# Altium project Light-Controller.PrjPcb
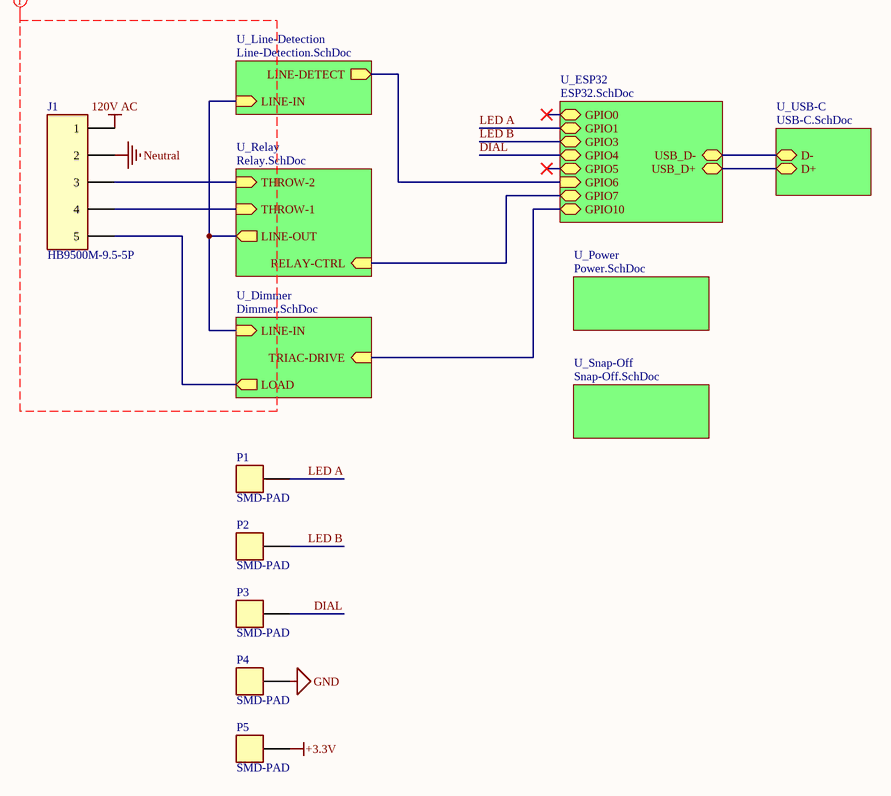
[diagram p0: Top-Level.SchDoc]
8 sheets, 66 parts. Net scope: hierarchical (ports join the sheet entries above them; power ports are global).
Board file: Light-Controller.PcbDoc
Sheets:
  Top-Level.SchDoc
    U_ESP32 = ESP32.SchDoc
    U_USB-C = USB-C.SchDoc
    U_Relay = Relay.SchDoc
    U_Dimmer = Dimmer.SchDoc
    U_Power = Power.SchDoc
    U_Line-Detection = Line-Detection.SchDoc
    U_Snap-Off = Snap-Off.SchDoc

## Sheet Top-Level.SchDoc
size A; SheetNumber: 1; SheetTotal: 8

### Parts
J1  HB9500M-9.5-5P  [CONN-TH_HB9500M-9.5-5P]
P1  SMD-PAD  [USER_SMD-PAD]  (no BOM)
P2  SMD-PAD  [USER_SMD-PAD]  (no BOM)
P3  SMD-PAD  [USER_SMD-PAD]  (no BOM)
P4  SMD-PAD  [USER_SMD-PAD]  (no BOM)
P5  SMD-PAD  [USER_SMD-PAD]  (no BOM)

### Sub-sheets
U_Dimmer = Dimmer.SchDoc: LOAD (out), TRIAC-DRIVE (in), LINE-IN (in)
U_ESP32 = ESP32.SchDoc: USB_D- (bidir), USB_D+ (bidir), GPIO10 (bidir), GPIO7 (bidir), GPIO6 (in), GPIO3 (bidir), GPIO4 (bidir), GPIO5 (bidir), GPIO0 (bidir), GPIO1 (bidir)
U_Line-Detection = Line-Detection.SchDoc: LINE-IN (in), LINE-DETECT (out)
U_Power = Power.SchDoc: no entries
U_Relay = Relay.SchDoc: RELAY-CTRL (in), THROW-1 (in), THROW-2 (in), LINE-OUT (out)
U_Snap-Off = Snap-Off.SchDoc: no entries
U_USB-C = USB-C.SchDoc: D- (bidir), D+ (bidir)

### Nets
120V AC: J1.1
+3.3V: P5.1
GND: P4.1
Neutral: J1.2
D_N: sheet U_ESP32/USB_D-, sheet U_USB-C/D-
D_P: sheet U_ESP32/USB_D+, sheet U_USB-C/D+
DIAL: P3.1 ; sheet U_ESP32/GPIO4
LED A: P1.1 ; sheet U_ESP32/GPIO1
LED B: P2.1 ; sheet U_ESP32/GPIO3
NetIC1_16: sheet U_ESP32/GPIO10, sheet U_Dimmer/TRIAC-DRIVE
NetIC1_20: sheet U_ESP32/GPIO6, sheet U_Line-Detection/LINE-DETECT
NetIC1_21: sheet U_ESP32/GPIO7, sheet U_Relay/RELAY-CTRL
NetJ1_3: J1.3 ; sheet U_Relay/THROW-2
NetJ1_4: J1.4 ; sheet U_Relay/THROW-1
NetJ1_5: J1.5 ; sheet U_Dimmer/LOAD
NetK1_2: sheet U_Relay/LINE-OUT, sheet U_Dimmer/LINE-IN, sheet U_Line-Detection/LINE-IN

### Layout directives
net class High-Voltage: 120V AC, Neutral

### Library data of the parts
J1 = HB9500M-9.5-5P: 1x5P Side Mount With Cover Plate 5 1 9.5mm -40℃~+105℃ 32A 750V Black 12~22 Straight Pin 4 Through Hole,P=9.5mm Barrier Terminal Blocks ROHS; LCSC Part Number: C601240
P1-P5 = SMD-PAD: SMD Pad for 18-22 AWG wire

## Sheet ESP32.SchDoc
size A; SheetNumber: 2; SheetTotal: 8
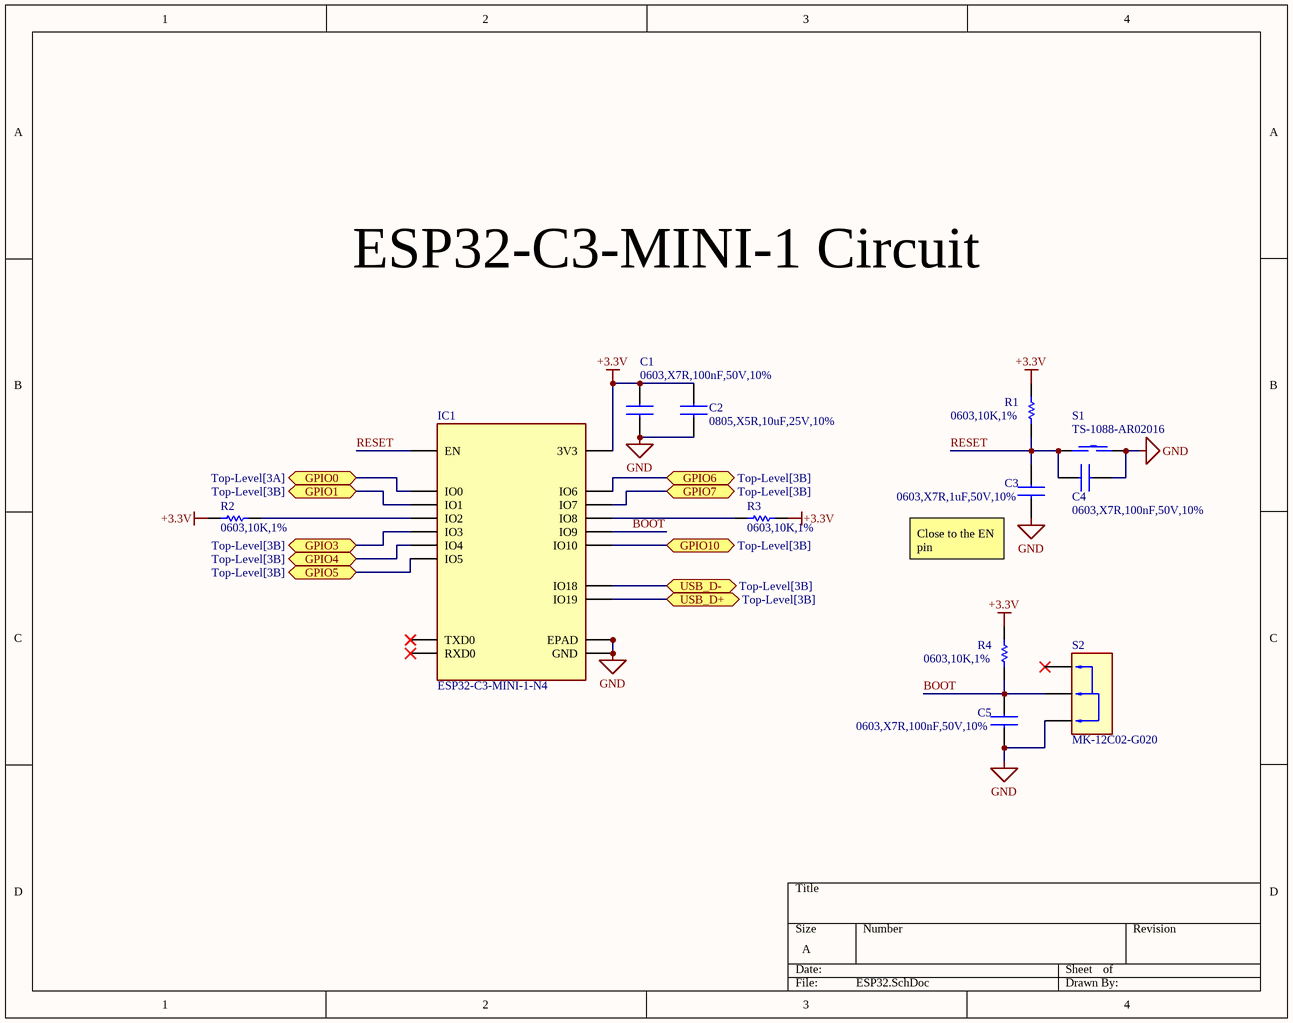
[diagram p1: ESP32.SchDoc]

### Parts
C1  0603,X7R,100nF,50V,10%  [CAPC1608X90N]
C2  0805,X5R,10uF,25V,10%  [CAPC2012X145N]
C3  0603,X7R,1uF,50V,10%  [CAPC1608X90N]
C4  0603,X7R,100nF,50V,10%  [CAPC1608X90N]
C5  0603,X7R,100nF,50V,10%  [CAPC1608X90N]
IC1  ESP32-C3-MINI-1-N4  [ESP32C3MINI1N4]
R1  0603,10K,1%  [RESC1608X55N]
R2  0603,10K,1%  [RESC1608X55N]
R3  0603,10K,1%  [RESC1608X55N]
R4  0603,10K,1%  [RESC1608X55N]
S1  TS-1088-AR02016  [SW-SMD_L3.9-W3.0-P4.45]
S2  MK-12C02-G020  [SW-SMD_MK-12C02-G020]

### Ports
GPIO0 (bidir, see Top-Level[3A]), GPIO1 (bidir, see Top-Level[3B]), GPIO3 (bidir, see Top-Level[3B]), GPIO4 (bidir, see Top-Level[3B]), GPIO5 (bidir, see Top-Level[3B]), GPIO6 (bidir, see Top-Level[3B]), GPIO7 (bidir, see Top-Level[3B]), GPIO10 (bidir, see Top-Level[3B]), USB_D+ (bidir, see Top-Level[3B]), USB_D- (bidir, see Top-Level[3B])

### Nets
+3.3V: C1.2 C2.2 IC1.3(3V3) R1.2 R2.2 R3.2 R4.2
GND: C1.1 C2.1 C3.1 C4.1 C5.2 IC1.1(GND) IC1.2(GND) IC1.11(GND) IC1.14(GND) IC1.36(GND) IC1.37(GND) IC1.38(GND) IC1.39(GND) IC1.40(GND) IC1.41(GND) IC1.42(GND) IC1.43(GND) IC1.44(GND) IC1.45(GND) IC1.46(GND) IC1.47(GND) IC1.48(GND) IC1.49(EPAD) IC1.50(EPAD) IC1.51(EPAD) IC1.52(EPAD) IC1.53(EPAD) IC1.54(EPAD) IC1.55(EPAD) IC1.56(EPAD) IC1.57(EPAD) IC1.58(GND) IC1.59(GND) IC1.60(GND) IC1.61(GND) S1.1 S2.3
BOOT: C5.1 IC1.23(IO9) R4.1 S2.2
D_N: IC1.26(IO18) ; port USB_D-
D_P: IC1.27(IO19) ; port USB_D+
DIAL: IC1.18(IO4) ; port GPIO4
LED A: IC1.13(IO1) ; port GPIO1
LED B: IC1.6(IO3) ; port GPIO3
RESET: C3.2 C4.2 IC1.8(EN) R1.1 S1.2
NetIC1_5: IC1.5(IO2) R2.1
NetIC1_12: IC1.12(IO0) ; port GPIO0
NetIC1_16: IC1.16(IO10) ; port GPIO10
NetIC1_19: IC1.19(IO5) ; port GPIO5
NetIC1_20: IC1.20(IO6) ; port GPIO6
NetIC1_21: IC1.21(IO7) ; port GPIO7
NetIC1_22: IC1.22(IO8) R3.1

Not connected (* = marked no-connect by the designer): IC1 30(RXD0)* 31(TXD0)*; S2 1*

### Notes on the sheet
- ESP32-C3-MINI-1 Circuit
- (near C3) Close to the EN pin

### Library data of the parts
C1 C4 C5 = CC0603KRX7R9BB104: 50V 100nF X7R ±10% 0603 Multilayer Ceramic Capacitors MLCC - SMD/SMT ROHS; Manufacturer_Name: YAGEO; Datasheet Link: https://componentsearchengine.com/Datasheets/2/CC0603KRX7R9BB104.pdf; Height: 0.9mm; Manufacturer_Part_Number: CC0603KRX7R9BB104; Mouser Part Number: 603-CC603KRX7R9BB104; Mouser Price/Stock: https://www.mouser.co.uk/ProductDetail/YAGEO/CC0603KRX7R9BB104?qs=vTakOoo5QyLvVCYM2ge8LQ%3D%3D; Arrow Part Number: CC0603KRX7R9BB104; Arrow Price/Stock: https://www.arrow.com/en/products/cc0603krx7r9bb104/yageo?utm_currency=USD&region=europe; JLCPCB Part #: C14663; LCSC Part Number: C14663
C2 = CC0805KKX5R8BB106: 10 µF ±10% 25V Ceramic Capacitor X5R 0805 (2012 Metric); Manufacturer_Name: YAGEO; Datasheet Link: https://www.yageo.com/upload/media/product/productsearch/datasheet/mlcc/UPY-GPHC_X5R_4V-to-50V_27.pdf; Height: 1.45mm; Manufacturer_Part_Number: CC0805KKX5R8BB106; Mouser Part Number: 603-CC805KKX5R8BB106; Mouser Price/Stock: https://www.mouser.co.uk/ProductDetail/YAGEO/CC0805KKX5R8BB106?qs=57cj7OiSijm89pM64t1AGQ%3D%3D; Arrow Part Number: CC0805KKX5R8BB106; Arrow Price/Stock: https://www.arrow.com/en/products/cc0805kkx5r8bb106/yageo?utm_currency=USD&region=nac; LCSC Part Number: C89831
C3 = CC0603KRX7R9BB105: 50V 1uF X7R ±10% 0603 Multilayer Ceramic Capacitors MLCC - SMD/SMT ROHS; Manufacturer_Name: YAGEO; Datasheet Link: https://www.yageo.com/upload/media/product/app/datasheet/mlcc/upy-gphc_x7r_6_3v-to-250v.pdf; Height: 0.95mm; Manufacturer_Part_Number: CC0603KRX7R9BB105; Mouser Part Number: 603-CC603KRX7R9BB105; Mouser Price/Stock: https://www.mouser.co.uk/ProductDetail/YAGEO/CC0603KRX7R9BB105?qs=6wERJjOp3mmF17%252BYi8cgJQ%3D%3D; Arrow Part Number: CC0603KRX7R9BB105; Arrow Price/Stock: https://www.arrow.com/en/products/cc0603krx7r9bb105/yageo?utm_currency=USD&region=nac; LCSC Part Number: C559769
IC1 = ESP32-C3-MINI-1-N4: Small-sized 2.4 GHz Wi-Fi (802.11b/g/n) and Bluetooth® 5 module / Built around ESP32-C3 series of SoCs, RISC-V single-core microprocessor / 4 MB flash in chip package / 15 GPIOs / On-board PCB antenna or external antenna connector; Manufacturer_Name: Espressif Systems; Datasheet Link: https://www.mouser.com/datasheet/2/891/Espressif_ESP32_C3_MINI_1_Datasheet-2006822.pdf; Height: 2.55mm; Manufacturer_Part_Number: ESP32-C3-MINI-1-N4; Mouser Part Number: 356-ESP32-C3-MINI1N4; Mouser Price/Stock: https://www.mouser.co.uk/ProductDetail/Espressif-Systems/ESP32-C3-MINI-1-N4?qs=stqOd1AaK7%252B%2FpH3qqyGehA%3D%3D; LCSC Part Number: C2838502
R1-R4 = RC0603FR-0710KL: 100mW Thick Film Resistor 75V ±100ppm/℃ ±1% 10kΩ 0603 Chip Resistor - Surface Mount ROHS; Manufacturer_Name: YAGEO; Datasheet Link: https://www.mouser.in/datasheet/2/447/PYu_RC_Group_51_RoHS_L_11-1984063.pdf; Height: 0.55mm; Manufacturer_Part_Number: RC0603FR-0710KL; Mouser Part Number: 603-RC0603FR-0710KL; Mouser Price/Stock: https://www.mouser.co.uk/ProductDetail/YAGEO/RC0603FR-0710KL?qs=grNVn54RoB%252B3GtjbJj3wJQ%3D%3D; Arrow Part Number: RC0603FR-0710KL; Arrow Price/Stock: https://www.arrow.com/en/products/rc0603fr-0710kl/yageo?utm_currency=USD&region=nac; LCSC Part Number: C98220
S1 = TS-1088-AR02016: Without Bracket 50mA 4mm 100,000 Cycles 12V 1.6N 3mm 2mm Round Button Surface Mount,Vertical SPST SMD Tactile Switches ROHS; LCSC Part Number: C720477
S2 = MK-12C02-G020: Surface Mount, Right Angle 1A SPDT 6V Black 10,000 Cycles SMD Slide Switches ROHS; LCSC Part Number: C963206

## Sheet USB-C.SchDoc
size A; SheetNumber: 3; SheetTotal: 8
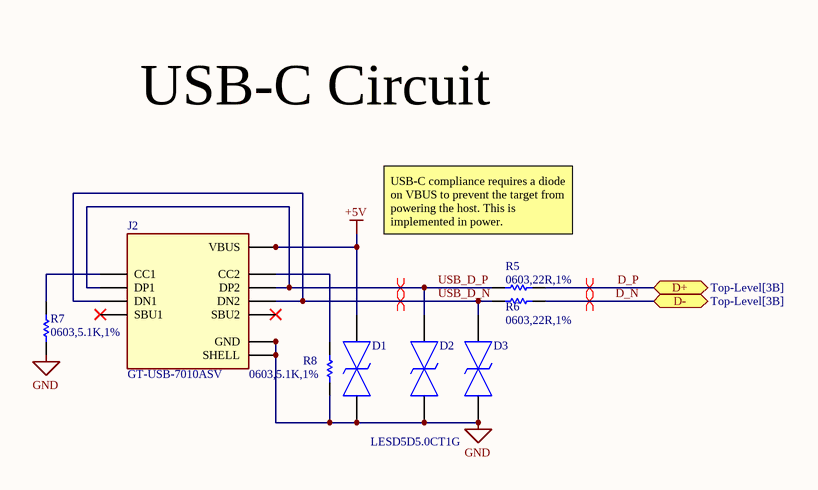
[diagram p2: USB-C.SchDoc]

### Parts
D1  LESD5D5.0CT1G  [LESD5D50CT1G]  (value not drawn)
D2  LESD5D5.0CT1G  [LESD5D50CT1G]  (value not drawn)
D3  LESD5D5.0CT1G  [LESD5D50CT1G]
J2  GT-USB-7010ASV  [USB-C-SMD_G-SWITCH_GT-USB-7010ASV]
R5  0603,22R,1%  [RESC1608X55N]
R6  0603,22R,1%  [RESC1608X55N]
R7  0603,5.1K,1%  [RESC1608X55N]
R8  0603,5.1K,1%  [RESC1608X55N]

### Ports
D+ (bidir, see Top-Level[3B]), D- (bidir, see Top-Level[3B])

### Nets
+5V: D1.2 J2.A4B9(VBUS) J2.B4A9(VBUS)
GND: D1.1 D2.1 D3.1 J2.1(SHELL) J2.2(SHELL) J2.3(SHELL) J2.4(SHELL) J2.A1B12(GND) J2.B1A12(GND) R7.1 R8.1
D_N: R6.2 ; port D-
D_P: R5.2 ; port D+
USB_D_N: D3.2 J2.A7(DN1) J2.B7(DN2) R6.1
USB_D_P: D2.2 J2.A6(DP1) J2.B6(DP2) R5.1
NetJ2_A5: J2.A5(CC1) R7.2
NetJ2_B5: J2.B5(CC2) R8.2

Not connected (* = marked no-connect by the designer): J2 A8(SBU1)* B8(SBU2)*

### Layout directives
differential pair: D_N, D_P, USB_D_N, USB_D_P

### Notes on the sheet
- USB-C Circuit
- USB-C compliance requires a diode on VBUS to prevent the target from powering the host. This is implemented in power.

### Library data of the parts
D1-D3 = LESD5D5.0CT1G: 9.4A 18.6V 5.6V Bidirectional 5V SOD-523 ESD and Surge Protection (TVS/ESD) ROHS; Manufacturer_Name: LRC; Height: 0.7mm; Manufacturer_Part_Number: LESD5D5.0CT1G; LCSC Part Number: C383211
J2 = GT-USB-7010ASV: USB 2.0 3A 1 Surface Mount, Right Angle 16P Female -40℃~+85℃ Type-C SMD USB Connectors ROHS; LCSC Part Number: C2988369
R5 R6 = RC0603FR-0722RL: 100mW Thick Film Resistor 75V ±100ppm/℃ ±1% 22Ω 0603 Chip Resistor - Surface Mount ROHS; Manufacturer_Name: YAGEO; Datasheet Link: http://www.farnell.com/datasheets/1868787.pdf; Height: 0.55mm; Manufacturer_Part_Number: RC0603FR-0722RL; Mouser Part Number: 603-RC0603FR-0722RL; Mouser Price/Stock: https://www.mouser.co.uk/ProductDetail/YAGEO/RC0603FR-0722RL?qs=diQw95jMAeMOsxb8bne7fg%3D%3D; Arrow Part Number: RC0603FR-0722RL; Arrow Price/Stock: https://www.arrow.com/en/products/rc0603fr-0722rl/yageo?region=nac; LCSC Part Number: C107701
R7 R8 = RC0603FR-075K1L: 100mW Thick Film Resistor 75V ±100ppm/℃ ±1% 5.1kΩ 0603 Chip Resistor - Surface Mount ROHS; Manufacturer_Name: YAGEO; Manufacturer_Part_Number: RC0603FR-0710KL; Datasheet Link: https://www.mouser.in/datasheet/2/447/PYu_RC_Group_51_RoHS_L_11-1984063.pdf; Height: 0.55mm; Mouser Part Number: 603-RC0603FR-0710KL; Mouser Price/Stock: https://www.mouser.co.uk/ProductDetail/YAGEO/RC0603FR-0710KL?qs=grNVn54RoB%252B3GtjbJj3wJQ%3D%3D; Arrow Part Number: RC0603FR-0710KL; Arrow Price/Stock: https://www.arrow.com/en/products/rc0603fr-0710kl/yageo?utm_currency=USD&region=nac; LCSC Part Number: C105580

## Sheet Relay.SchDoc
size A; SheetNumber: 4; SheetTotal: 8
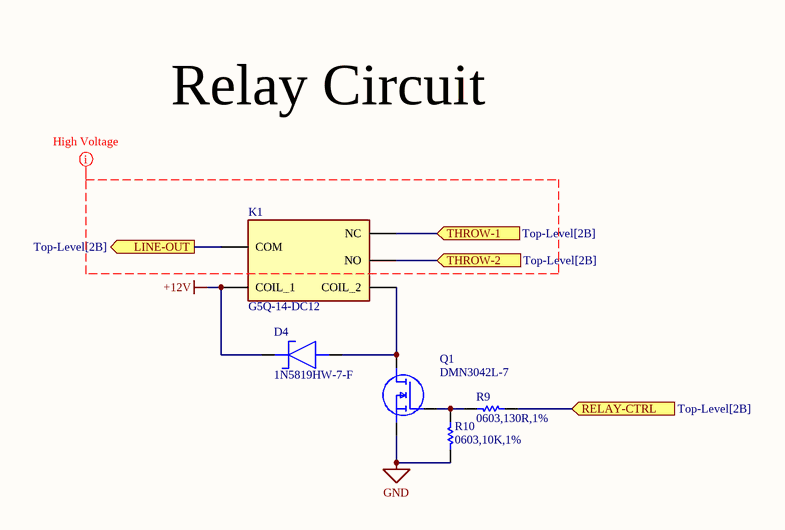
[diagram p3: Relay.SchDoc]

### Parts
D4  1N5819HW-7-F  [SOD3716X145N]
K1  G5Q-14-DC12  [G5Q14DC12]
Q1  DMN3042L-7  [SOT96P240X115-3N]
R9  0603,130R,1%  [RESC1608X55N]
R10  0603,10K,1%  [RESC1608X55N]

### Ports
LINE-OUT (out, see Top-Level[2B]), RELAY-CTRL (in, see Top-Level[2B]), THROW-1 (in, see Top-Level[2B]), THROW-2 (in, see Top-Level[2B])

### Nets
+12V: D4.1(K) K1.1(COIL_1)
GND: Q1.2(S) R10.1
NetD4_2: D4.2(A) K1.5(COIL_2) Q1.3(D)
NetIC1_21: R9.1 ; port RELAY-CTRL
NetJ1_3: K1.3(NO) ; port THROW-2
NetJ1_4: K1.4(NC) ; port THROW-1
NetK1_2: K1.2(COM) ; port LINE-OUT
NetQ1_1: Q1.1(G) R9.2 R10.2

### Layout directives
net class High-Voltage: (no net found under the mark)

### Notes on the sheet
- Relay Circuit

### Library data of the parts
D4 = 1N5819HW-7-F: 40V 450mV@1A 1A SOD-123 Schottky Diodes ROHS; Manufacturer_Name: Diodes Incorporated; Datasheet Link: https://www.diodes.com//assets/Datasheets/1N5819HW.pdf; Height: 1.45mm; Manufacturer_Part_Number: 1N5819HW-7-F; Mouser Part Number: 621-1N5819HW-F; Mouser Price/Stock: https://www.mouser.co.uk/ProductDetail/Diodes-Incorporated/1N5819HW-7-F?qs=NQ47qNm99eDyWTEd07miYA%3D%3D; Arrow Part Number: 1N5819HW-7-F; Arrow Price/Stock: https://www.arrow.com/en/products/1n5819hw-7-f/diodes-incorporated?utm_currency=USD&region=nac; LCSC Part Number: C82544
K1 = G5Q-14-DC12: 12V 10A 1 Form C: 1C (SPDT-CO) Through Hole,10x20mm Power Relays ROHS; Manufacturer_Name: Omron Electronics; Datasheet Link: https://datasheet.lcsc.com/szlcsc/Omron-Electronics-G5Q-14-DC12_C225715.pdf; Height: 16.2mm; Manufacturer_Part_Number: G5Q-14-DC12; Mouser Part Number: 653-G5Q-14-DC12; Mouser Price/Stock: https://www.mouser.co.uk/ProductDetail/Omron-Electronics/G5Q-14-DC12?qs=lK7M36XCk6KX8SEFaHI6UQ%3D%3D; Arrow Part Number: G5Q-14-DC12; Arrow Price/Stock: https://www.arrow.com/en/products/g5q-14-dc12/omron?utm_currency=USD&region=nac; LCSC Part Number: C225715
Q1 = DMN3042L-7: N-Channel 30 V 5.8A (Ta) 720mW (Ta) Surface Mount SOT-23-3; Manufacturer_Name: Diodes Incorporated; Datasheet Link: https://www.diodes.com//assets/Datasheets/DMN3042L.pdf; Height: 1.15mm; Manufacturer_Part_Number: DMN3042L-7; Mouser Part Number: 621-DMN3042L-7; Mouser Price/Stock: https://www.mouser.co.uk/ProductDetail/Diodes-Incorporated/DMN3042L-7?qs=BvpHGKeVh3rQK2Uscu7jEw%3D%3D; Arrow Part Number: DMN3042L-7; Arrow Price/Stock: https://www.arrow.com/en/products/dmn3042l-7/diodes-incorporated?utm_currency=USD&region=nac; LCSC Part Number: C2838502
R9 = RC0603FR-07130RL: 130 Ohms ±1% 0.1W, 1/10W Chip Resistor 0603 (1608 Metric) Moisture Resistant Thick Film; Manufacturer_Name: YAGEO; Datasheet Link: https://www.mouser.com/catalog/specsheets/YAGEO_PYu_RC_Group_51_RoHS_L_12.pdf; Height: 0.55mm; Manufacturer_Part_Number: RC0603FR-07130RL; LCSC Part Number: C141677
R10 = RC0603FR-0710KL: as R1 on sheet ESP32; Datasheet Link: https://www.mouser.in/datasheet/2/447/PYu_RC_Group_51_RoHS_L_11-1984063.pdf; Height: 0.55mm; Manufacturer_Part_Number: RC0603FR-0710KL; Mouser Part Number: 603-RC0603FR-0710KL; Mouser Price/Stock: https://www.mouser.co.uk/ProductDetail/YAGEO/RC0603FR-0710KL?qs=grNVn54RoB%252B3GtjbJj3wJQ%3D%3D; Arrow Part Number: RC0603FR-0710KL; Arrow Price/Stock: https://www.arrow.com/en/products/rc0603fr-0710kl/yageo?utm_currency=USD&region=nac; LCSC Part Number: C98220

## Sheet Dimmer.SchDoc
size A; SheetNumber: 6; SheetTotal: 8
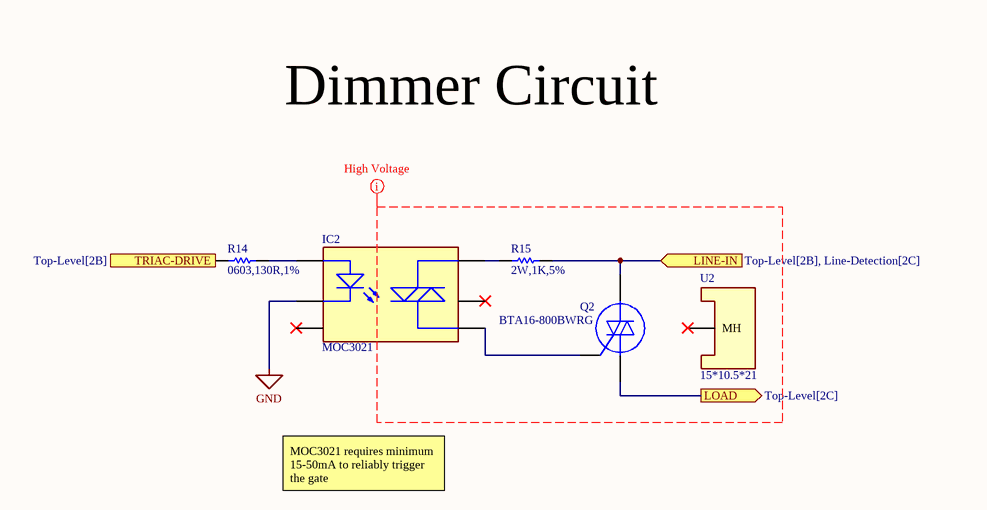
[diagram p4: Dimmer.SchDoc]

### Parts
IC2  MOC3021  [DIP-6_L8.5-W6.4-P2.54-LS7.6-BL]
Q2  BTA16-800BWRG  [TO255P1020X450X1965-3]
R14  0603,130R,1%  [RESC1608X55N]
R15  2W,1K,5%  [RES-TH_BD4.0-L11.5-P15.50-D0.7]
U2  15*10.5*21  [SINK-TH_L15.0-W10.5-H21.0]

### Ports
LINE-IN (in, see Top-Level[2B], Line-Detection[2C]), LOAD (out, see Top-Level[2C]), TRIAC-DRIVE (in, see Top-Level[2B])

### Nets
GND: IC2.2(CATHODE)
NetIC1_16: R14.1 ; port TRIAC-DRIVE
NetIC2_1: IC2.1(ANODE) R14.2
NetIC2_4: IC2.4(MAIN_TERMINAL_1) Q2.3(G)
NetIC2_6: IC2.6(MAIN_TERMINAL_2) R15.1
NetJ1_5: Q2.1(A1) ; port LOAD
NetK1_2: Q2.2(A2) R15.2 ; port LINE-IN

Not connected (* = marked no-connect by the designer): IC2 3(NC)* 5(SUBSTRATE)*; U2 1(MH)*

### Layout directives
net class High-Voltage: (no net found under the mark)

### Notes on the sheet
- Dimmer Circuit
- MOC3021 requires minimum 15-50mA to reliably trigger the gate

### Library data of the parts
IC2 = MOC3021: 1000V/us 50mA 400V 1.15V TRIAC DIP-6 Triac, SCR Output Optoisolators ROHS; Manufacturer_Name: Lite-On; Manufacturer_Part_Number: MOC3020; Datasheet Link: https://www.arrow.com/en/products/moc3020/lite-on-technology?region=nac; Height: 4.5mm; Mouser Part Number: 859-MOC3020; Mouser Price/Stock: https://www.mouser.co.uk/ProductDetail/Lite-On/MOC3020?qs=kgKJAWzqwChc9Zw3a0r80A%3D%3D; Arrow Part Number: MOC3020; Arrow Price/Stock: null?region=nac; LCSC Part Number: C123202
Q2 = BTA16-800BWRG: 35mA 50mA 800V 1 TRIAC TO-220AB Thyristors (SCR)/Modules ROHS; Manufacturer_Name: STMicroelectronics; Datasheet Link: http://www.st.com/web/en/resource/technical/document/datasheet/CD00002265.pdf; Height: 4.6mm; Manufacturer_Part_Number: BTA16-800BWRG; Mouser Part Number: 511-BTA16-800BW; Mouser Price/Stock: https://www.mouser.co.uk/ProductDetail/STMicroelectronics/BTA16-800BWRG?qs=pt%2FMICWRfHvPicwiGmWB%252BA%3D%3D; Arrow Part Number: BTA16-800BWRG; Arrow Price/Stock: https://www.arrow.com/en/products/bta16-800bwrg/stmicroelectronics?utm_currency=USD&region=europe; LCSC Part Number: C10065
R14 = RC0603FR-07130RL: as R9 on sheet Relay; Datasheet Link: https://www.mouser.com/catalog/specsheets/YAGEO_PYu_RC_Group_51_RoHS_L_12.pdf; Height: 0.55mm; Manufacturer_Part_Number: RC0603FR-07130RL; LCSC Part Number: C141677
R15 = FMP200JR-52-1K: Metal Film Resistor 1kΩ 2W ±5% Through Hole,D3.9xL9mm Through Hole Resistors ROHS; LCSC Part Number: C1740167
U2 = 15*10.5*21: 15.5*10.5*21MM 6063-T5 Heat sink / cooling fin ROHS; LCSC Part Number: C7421513

## Sheet Power.SchDoc
size A; SheetNumber: 7; SheetTotal: 8
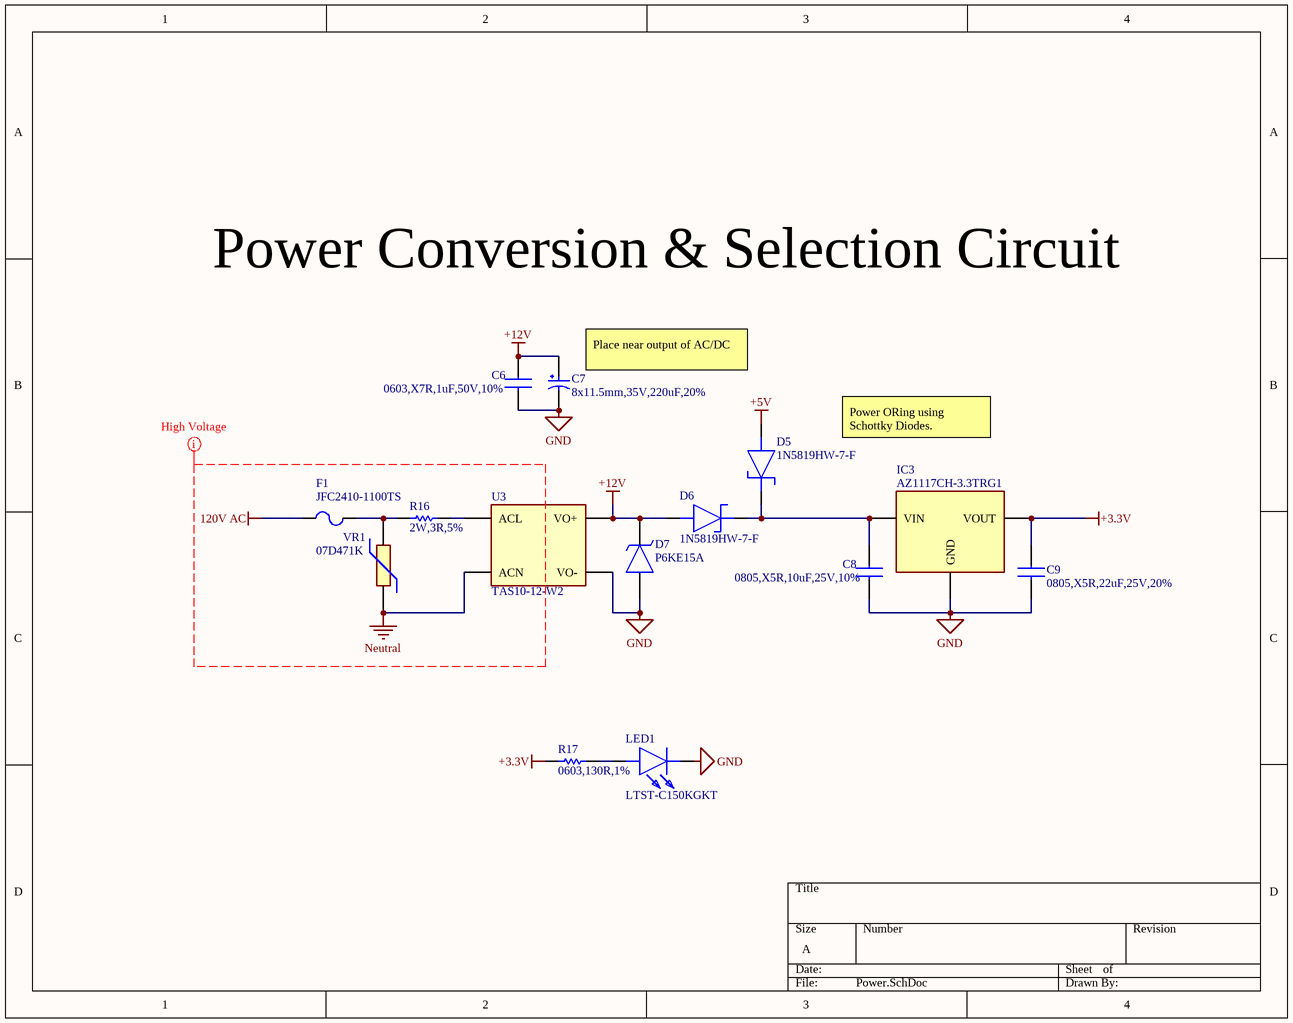
[diagram p5: Power.SchDoc]

### Parts
C6  0603,X7R,1uF,50V,10%  [CAPC1608X90N]
C7  8x11.5mm,35V,220uF,20%  [CAPPRD350W60D825H1350]
C8  0805,X5R,10uF,25V,10%  [CAPC2012X145N]
C9  0805,X5R,22uF,25V,20%  [CAPC2012X145N]
D5  1N5819HW-7-F  [SOD3716X145N]
D6  1N5819HW-7-F  [SOD3716X145N]
D7  P6KE15A  [DIOAD1936W88L640D324]
F1  JFC2410-1100TS  [F2410]
IC3  AZ1117CH-3.3TRG1  [SOT230P700X180-4N]
LED1  LTST-C150KGKT  [LEDC3216X120N]
R16  2W,3R,5%  [RES-TH_BD4.0-L11.5-P15.50-D0.7]
R17  0603,130R,1%  [RESC1608X55N]
U3  TAS10-12-W2  [PWRM-TH_TAS10-XX-W2]
VR1  07D471K  [RES-TH_L9.0-W6.2-P5.00-D0.7-S6.20]

### Nets
120V AC: F1.1
+3.3V: C9.2 IC3.2(OUTPUT) IC3.4(VOUT) R17.2
+5V: D5.2(A)
+12V: C6.2 C7.1(+) D6.2(A) D7.1(K) U3.6(VO+)
GND: C6.1 C7.2(-) C8.1 C9.1 D7.2(A) IC3.1(GND) LED1.1(K) U3.4(VO-)
Neutral: U3.1(ACN) VR1.1
NetC8_2: C8.2 D5.1(K) D6.1(K) IC3.3(VIN)
NetF1_2: F1.2 R16.1 VR1.2
NetLED1_2: LED1.2(A) R17.1
NetR16_2: R16.2 U3.2(ACL)

### Layout directives
net class High-Voltage: 120V AC, Neutral

### Notes on the sheet
- Power Conversion & Selection Circuit
- (near C7) Place near output of AC/DC
- Power ORing using Schottky Diodes.

### Library data of the parts
C6 = CC0603KRX7R9BB105: as C3 on sheet ESP32; Datasheet Link: https://www.yageo.com/upload/media/product/app/datasheet/mlcc/upy-gphc_x7r_6_3v-to-250v.pdf; Height: 0.95mm; Manufacturer_Part_Number: CC0603KRX7R9BB105; Mouser Part Number: 603-CC603KRX7R9BB105; Mouser Price/Stock: https://www.mouser.co.uk/ProductDetail/YAGEO/CC0603KRX7R9BB105?qs=6wERJjOp3mmF17%252BYi8cgJQ%3D%3D; Arrow Part Number: CC0603KRX7R9BB105; Arrow Price/Stock: https://www.arrow.com/en/products/cc0603krx7r9bb105/yageo?utm_currency=USD&region=nac; LCSC Part Number: C559769
C7 = 35ZLH220MEFC8X11.5: 220uF 35V 472.5mA@120Hz ±20% Through Hole,D8xL11.5mm Aluminum Electrolytic Capacitors - Leaded ROHS; Manufacturer_Name: Rubycon; Datasheet Link: http://www.rubycon.co.jp/EN/CATALOG/E_PDFS/ALUMINUM/E_ZLH.PDF; Height: 13.5mm; Manufacturer_Part_Number: 35ZLH220MEFC8X11.5; Mouser Part Number: 232-35ZLH220MEFC8X15; Mouser Price/Stock: https://www.mouser.co.uk/ProductDetail/Rubycon/35ZLH220MEFC8X11.5?qs=T3oQrply3y%252BhdplO5%252Bmtcg%3D%3D; Arrow Part Number: 35ZLH220MEFC8X11.5; Arrow Price/Stock: https://www.arrow.com/en/products/35zlh220mefc8x11.5/rubycon?utm_currency=USD&region=nac; LCSC Part Number: C107639
C8 = CC0805KKX5R8BB106: as C2 on sheet ESP32; Datasheet Link: https://www.yageo.com/upload/media/product/productsearch/datasheet/mlcc/UPY-GPHC_X5R_4V-to-50V_27.pdf; Height: 1.45mm; Manufacturer_Part_Number: CC0805KKX5R8BB106; Mouser Part Number: 603-CC805KKX5R8BB106; Mouser Price/Stock: https://www.mouser.co.uk/ProductDetail/YAGEO/CC0805KKX5R8BB106?qs=57cj7OiSijm89pM64t1AGQ%3D%3D; Arrow Part Number: CC0805KKX5R8BB106; Arrow Price/Stock: https://www.arrow.com/en/products/cc0805kkx5r8bb106/yageo?utm_currency=USD&region=nac; LCSC Part Number: C89831
C9 = CC0805MKX5R8BB226: 22 µF ±20% 25V Ceramic Capacitor X5R 0805 (2012 Metric); Manufacturer_Name: YAGEO; Datasheet Link: https://www.yageo.com/upload/media/product/productsearch/datasheet/mlcc/UPY-GPHC_X5R_4V-to-50V_26.pdf; Height: 1.45mm; Manufacturer_Part_Number: CC0805MKX5R8BB226; Mouser Part Number: 603-CC805MKX5R8BB226; Mouser Price/Stock: https://www.mouser.co.uk/ProductDetail/YAGEO/CC0805MKX5R8BB226?qs=WS5Jv%252B%252Bx1qULWDK6O%2FQuig%3D%3D; LCSC Part Number: C784585
D5 D6 = 1N5819HW-7-F: as D4 on sheet Relay; Datasheet Link: https://www.diodes.com//assets/Datasheets/1N5819HW.pdf; Height: 1.45mm; Manufacturer_Part_Number: 1N5819HW-7-F; Mouser Part Number: 621-1N5819HW-F; Mouser Price/Stock: https://www.mouser.co.uk/ProductDetail/Diodes-Incorporated/1N5819HW-7-F?qs=NQ47qNm99eDyWTEd07miYA%3D%3D; Arrow Part Number: 1N5819HW-7-F; Arrow Price/Stock: https://www.arrow.com/en/products/1n5819hw-7-f/diodes-incorporated?utm_currency=USD&region=nac; LCSC Part Number: C82544
D7 = P6KE15A: 147A@8/20us 600W@10/1000us 27.2V 15.8V Unidirectional 13V DO-15 ESD and Surge Protection (TVS/ESD) ROHS; Manufacturer_Name: STMicroelectronics; Datasheet Link: http://www.st.com/web/en/resource/technical/document/datasheet/CD00000720.pdf; Manufacturer_Part_Number: P6KE15A; Mouser Part Number: 511-P6KE15A; Mouser Price/Stock: https://www.mouser.co.uk/ProductDetail/STMicroelectronics/P6KE15A?qs=TGPpmpbSrT5hhHGF%252BJ4hqw%3D%3D; Arrow Part Number: P6KE15A; Arrow Price/Stock: https://www.arrow.com/en/products/p6ke15a/stmicroelectronics?region=nac; LCSC Part Number: C1974865
F1 = JFC2410-1100TS: 50A Surface Mount Fuse 1A 250V 250V 2410 Disposable fuses ROHS; LCSC Part Number: C136380
IC3 = AZ1117CH-3.3TRG1: 70dB@(120Hz) 1.35A Fixed 3.3V Positive 10V SOT-223 Voltage Regulators - Linear, Low Drop Out (LDO) Regulators ROHS; Manufacturer_Name: Diodes Incorporated; Datasheet Link: https://www.diodes.com//assets/Datasheets/AZ1117C.pdf; Height: 1.8mm; Manufacturer_Part_Number: AZ1117CH-3.3TRG1; Mouser Part Number: 621-AZ1117CH-3.3TRG1; Mouser Price/Stock: https://www.mouser.co.uk/ProductDetail/Diodes-Incorporated/AZ1117CH-3.3TRG1?qs=FKu9oBikfSm7ntaG6olPSQ%3D%3D; Arrow Part Number: AZ1117CH-3.3TRG1; Arrow Price/Stock: https://www.arrow.com/en/products/az1117ch-3.3trg1/diodes-incorporated?utm_currency=USD&region=nac; LCSC Part Number: C92102
LED1 = LTST-C150KGKT: 20mA 44.5mcd Water Clear -55℃~+85℃ 571nm Yellow Green 130° 75mW 2V 1206 LED Indication - Discrete ROHS; Manufacturer_Name: Lite-On; Datasheet Link: http://optoelectronics.liteon.com/upload/download/ds22-2000-072/ltst-c150kgkt.pdf; Height: 1.2mm; Manufacturer_Part_Number: LTST-C150KGKT; Mouser Part Number: 859-LTST-C150KGKT; Mouser Price/Stock: https://www.mouser.co.uk/ProductDetail/Lite-On/LTST-C150KGKT?qs=G7lFeYdtIHB%2FzaFKBwEyXw%3D%3D; Arrow Part Number: LTST-C150KGKT; Arrow Price/Stock: https://www.arrow.com/en/products/ltst-c150kgkt/lite-on-technology?utm_currency=USD&region=nac; LCSC Part Number: C125085
R16 = MFR2WSJT-73-3R: Metal Film Resistor 3Ω 2W ±5% Through Hole,D4.5xL11.5mm Through Hole Resistors ROHS; LCSC Part Number: C176580
R17 = RC0603FR-07130RL: as R9 on sheet Relay; Datasheet Link: https://www.mouser.com/catalog/specsheets/YAGEO_PYu_RC_Group_51_RoHS_L_12.pdf; Height: 0.55mm; Manufacturer_Part_Number: RC0603FR-07130RL; LCSC Part Number: C141677
U3 = TAS10-12-W2: 12V 830mA 85VAC~265VAC 100V~370V 10W AC/DC-DC 85% Through Hole,25x39mm AC-DC Power Modules ROHS; LCSC Part Number: C2687656
VR1 = 07D471K: 775V 385V 300V 423V~517V Through Hole,P=5mm Varistors ROHS; LCSC Part Number: C28756

## Sheet Line-Detection.SchDoc
size A; SheetNumber: 5; SheetTotal: 8
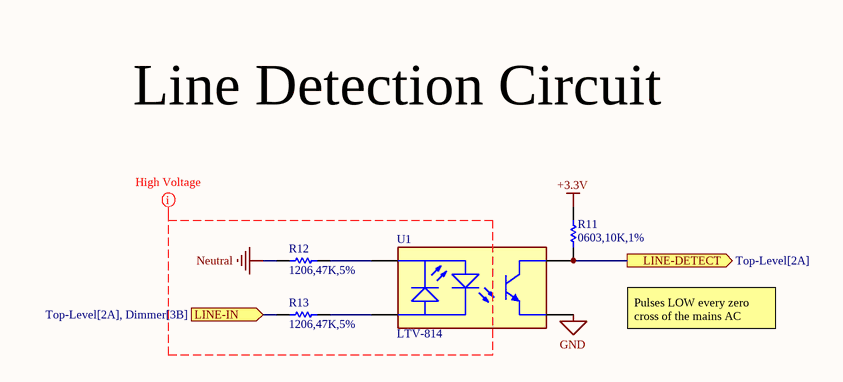
[diagram p6: Line-Detection.SchDoc]

### Parts
R11  0603,10K,1%  [RESC1608X55N]
R12  1206,47K,5%  [RESC3116X65N]
R13  1206,47K,5%  [RESC3116X65N]
U1  LTV-814  [DIP-4_L6.5-W4.6-P2.54-LS7.6-BL]

### Ports
LINE-DETECT (out, see Top-Level[2A]), LINE-IN (in, see Top-Level[2A], Dimmer[3B])

### Nets
+3.3V: R11.2
GND: U1.3(Emitter)
Neutral: R12.1
NetIC1_20: R11.1 U1.4(Collector) ; port LINE-DETECT
NetK1_2: R13.1 ; port LINE-IN
NetR12_2: R12.2 U1.1(Anode/Cathode)
NetR13_2: R13.2 U1.2(Anode/Cathode)

### Layout directives
net class High-Voltage: Neutral

### Notes on the sheet
- Line Detection Circuit
- Pulses LOW every zero cross of the mains AC

### Library data of the parts
R11 = RC0603FR-0710KL: as R1 on sheet ESP32; Datasheet Link: https://www.mouser.in/datasheet/2/447/PYu_RC_Group_51_RoHS_L_11-1984063.pdf; Height: 0.55mm; Manufacturer_Part_Number: RC0603FR-0710KL; Mouser Part Number: 603-RC0603FR-0710KL; Mouser Price/Stock: https://www.mouser.co.uk/ProductDetail/YAGEO/RC0603FR-0710KL?qs=grNVn54RoB%252B3GtjbJj3wJQ%3D%3D; Arrow Part Number: RC0603FR-0710KL; Arrow Price/Stock: https://www.arrow.com/en/products/rc0603fr-0710kl/yageo?utm_currency=USD&region=nac; LCSC Part Number: C98220
R12 R13 = RC1206JR-7W47KL: 500mW Thick Film Resistor ±5% ±200ppm/℃ 47kΩ 1206 Chip Resistor - Surface Mount ROHS; MP: RC1206JR-070RL; MF: Yageo; Purchase-URL: https://pricing.snapeda.com/search/part/RC1206JR-070RL/?ref=eda; Package: 1206 Yageo; Availability: In Stock; Check_prices: https://www.snapeda.com/parts/RC1206JR-070RL/Yageo/view-part/?ref=eda; Value: *; SnapEDA_Link: https://www.snapeda.com/parts/RC1206JR-070RL/Yageo/view-part/?ref=snap; Price: None; LCSC Part Number: C20164413
U1 = LTV-814: 35V 5kV 50mA 100mV@20mA,1mA 1 1.2V DC SMD-4P Transistor, Photovoltaic Output Optoisolators ROHS; LCSC Part Number: C10790

## Sheet Snap-Off.SchDoc
size A; SheetNumber: 8; SheetTotal: 8
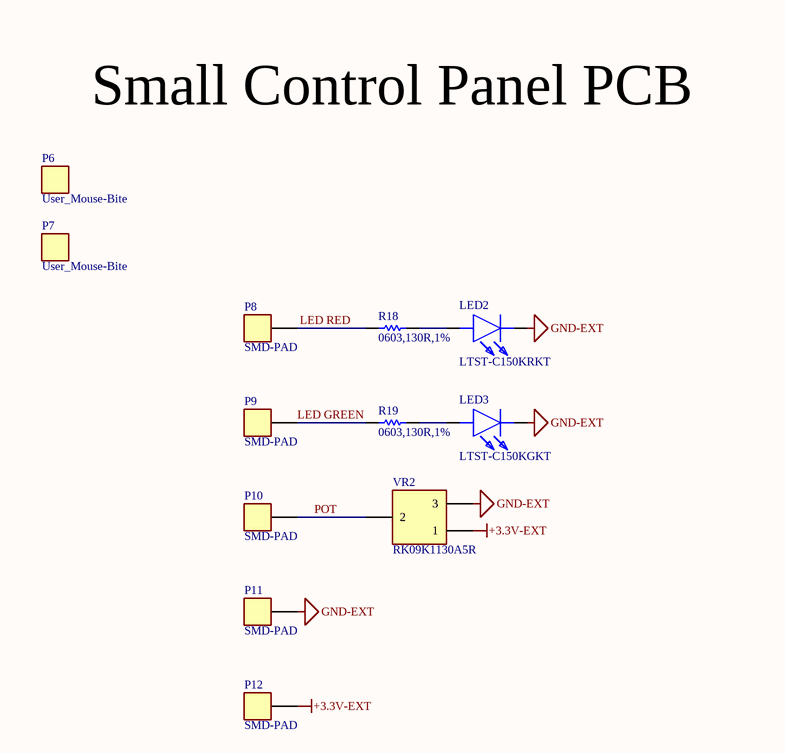
[diagram p7: Snap-Off.SchDoc]

### Parts
LED2  LTST-C150KRKT  [LEDC3216X120N]
LED3  LTST-C150KGKT  [LEDC3216X120N]
P6  User_Mouse-Bite  [mouse-bite-3mm-slot]  (no BOM)
P7  User_Mouse-Bite  [mouse-bite-3mm-slot]  (no BOM)
P8  SMD-PAD  [USER_SMD-PAD]  (no BOM)
P9  SMD-PAD  [USER_SMD-PAD]  (no BOM)
P10  SMD-PAD  [USER_SMD-PAD]  (no BOM)
P11  SMD-PAD  [USER_SMD-PAD]  (no BOM)
P12  SMD-PAD  [USER_SMD-PAD]  (no BOM)
R18  0603,130R,1%  [RESC1608X55N]
R19  0603,130R,1%  [RESC1608X55N]
VR2  RK09K1130A5R  [RES-ADJ-TH_RK09D1130C4G]

### Nets
+3.3V-EXT: P12.1 VR2.1
GND-EXT: LED2.1(K) LED3.1(K) P11.1 VR2.3
LED GREEN: P9.1 R19.1
LED RED: P8.1 R18.1
POT: P10.1 VR2.2
NetLED2_2: LED2.2(A) R18.2
NetLED3_2: LED3.2(A) R19.2

### Notes on the sheet
- (near P6) Small Control Panel PCB

### Library data of the parts
LED2 = LTST-C150KRKT: 20mA 54mcd Water Clear -30℃~+85℃ 624nm Red 130° 62.5mW 2V 1206 LED Indication - Discrete ROHS; Manufacturer_Name: Lite-On; Datasheet Link: https://optoelectronics.liteon.com/upload/download/DS-22-99-0149/LTST-C150KRKT.pdf; Height: 1.2mm; Manufacturer_Part_Number: LTST-C150KRKT; Mouser Part Number: 859-LTST-C150KRKT; Mouser Price/Stock: https://www.mouser.co.uk/ProductDetail/Lite-On/LTST-C150KRKT?qs=EfspBadgGjC5L5YGrXjS9g%3D%3D; Arrow Part Number: LTST-C150KRKT; Arrow Price/Stock: https://www.arrow.com/en/products/ltst-c150krkt/lite-on-technology?utm_currency=USD&region=nac; LCSC Part Number: C125086
LED3 = LTST-C150KGKT: as LED1 on sheet Power; Datasheet Link: http://optoelectronics.liteon.com/upload/download/ds22-2000-072/ltst-c150kgkt.pdf; Height: 1.2mm; Manufacturer_Part_Number: LTST-C150KGKT; Mouser Part Number: 859-LTST-C150KGKT; Mouser Price/Stock: https://www.mouser.co.uk/ProductDetail/Lite-On/LTST-C150KGKT?qs=G7lFeYdtIHB%2FzaFKBwEyXw%3D%3D; Arrow Part Number: LTST-C150KGKT; Arrow Price/Stock: https://www.arrow.com/en/products/ltst-c150kgkt/lite-on-technology?utm_currency=USD&region=nac; LCSC Part Number: C125085
P6 P7 = User_Mouse-Bite: 3mm Mouse Bites
P8-P12 = SMD-PAD: SMD Pad for 18-22 AWG wire
R18 R19 = RC0603FR-07130RL: as R9 on sheet Relay; Datasheet Link: https://www.mouser.com/catalog/specsheets/YAGEO_PYu_RC_Group_51_RoHS_L_12.pdf; Height: 0.55mm; Manufacturer_Part_Number: RC0603FR-07130RL; LCSC Part Number: C141677
VR2 = RK09K1130A5R: ±20% 50mW 5kΩ Through Hole Potentiometers, Variable Resistors ROHS; Manufacturer_Name: ALPS Electric; Manufacturer_Part_Number: RK09K1130AV7; Mouser Part Number: 688-RK09K1130AV7; Mouser Price/Stock: https://www.mouser.co.uk/ProductDetail/Alps-Alpine/RK09K1130AV7?qs=6EGMNY9ZYDTktmKuM5MDvw%3D%3D; LCSC Part Number: C209779

## Nets that join several sheets
120V AC: Top-Level (J1.1), Power (F1.1)
+3.3V: Top-Level (P5.1), ESP32 (7 pins), Power (C9.2 IC3.2 IC3.4 R17.2), Line-Detection (R11.2)
+5V: USB-C (D1.2 J2.A4B9 J2.B4A9), Power (D5.2)
+12V: Relay (D4.1 K1.1), Power (5 pins)
GND: Top-Level (P4.1), ESP32 (37 pins), USB-C (11 pins), Relay (Q1.2 R10.1), Dimmer (IC2.2), Power (8 pins), Line-Detection (U1.3)
Neutral: Top-Level (J1.2), Power (U3.1 VR1.1), Line-Detection (R12.1)
D_N: ESP32 (IC1.26), USB-C (R6.2)
D_P: ESP32 (IC1.27), USB-C (R5.2)
DIAL: Top-Level (P3.1), ESP32 (IC1.18)
LED A: Top-Level (P1.1), ESP32 (IC1.13)
LED B: Top-Level (P2.1), ESP32 (IC1.6)
NetIC1_16: ESP32 (IC1.16), Dimmer (R14.1)
NetIC1_20: ESP32 (IC1.20), Line-Detection (R11.1 U1.4)
NetIC1_21: ESP32 (IC1.21), Relay (R9.1)
NetJ1_3: Top-Level (J1.3), Relay (K1.3)
NetJ1_4: Top-Level (J1.4), Relay (K1.4)
NetJ1_5: Top-Level (J1.5), Dimmer (Q2.1)
NetK1_2: Relay (K1.2), Dimmer (Q2.2 R15.2), Line-Detection (R13.1)